# EasyEDA schematic 原理图.json
TITLE: Sheet_1; REV: 1.0; Date: 2021-08-09; Sheet: 1/1; Drawn By: pomin; Company: Your Company
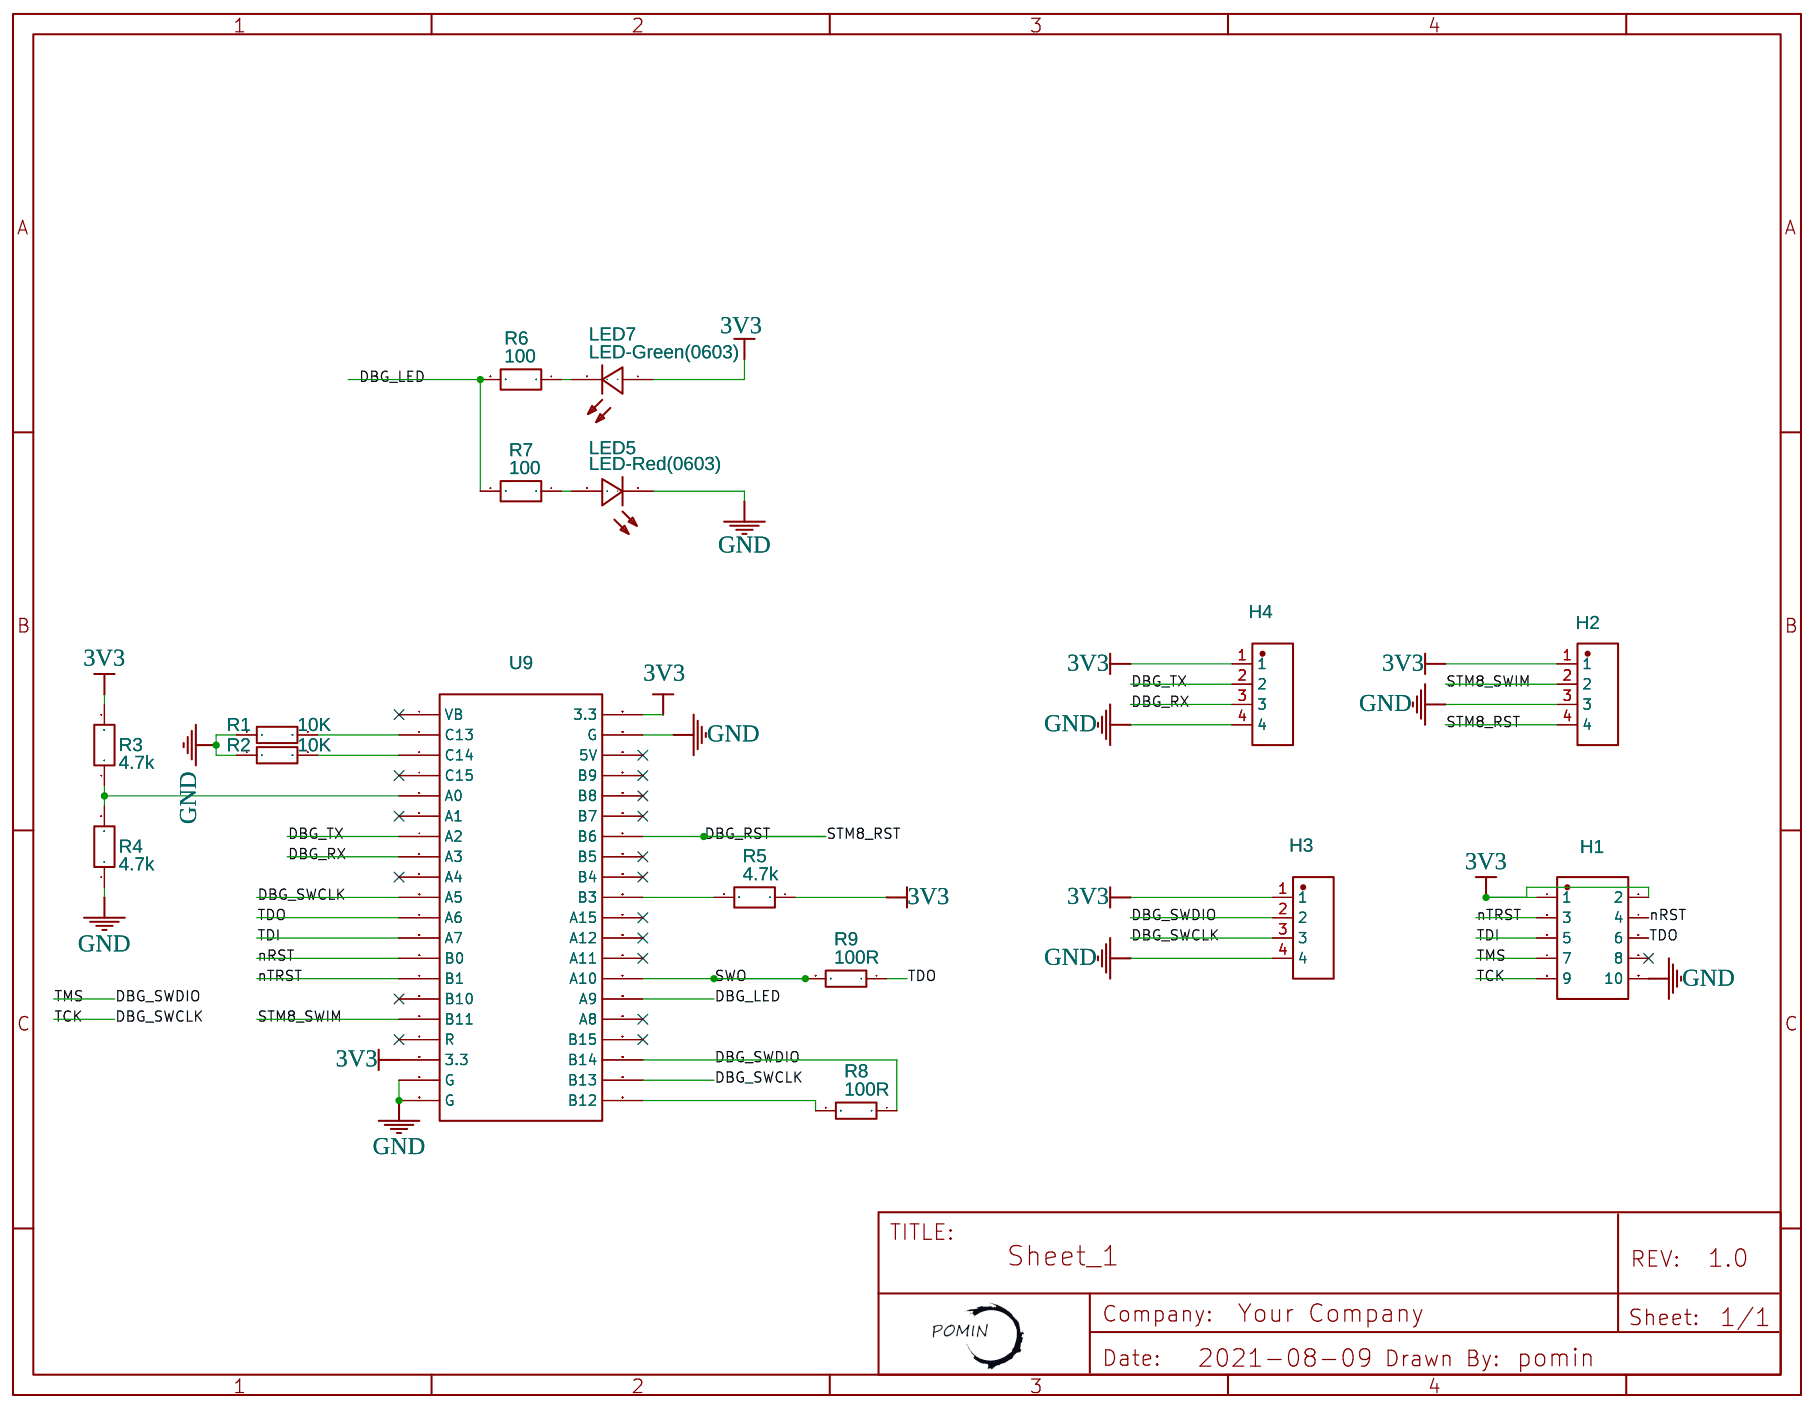
[diagram p0: schematic sheet]

## Parts
H1  Female header2.54mm2*5p Straight  [HDR-TH_10P-P2.54-V-F-R2-C5-S2.54]
H2  2.54-1*4P母  [HDR-TH_4P-P2.54-V-F]
H3  2.54-1*4P母  [HDR-TH_4P-P2.54-V-F]
H4  2.54-1*4P母  [HDR-TH_4P-P2.54-V-F]
LED5  LED-Red(0603)  [LED-0805]
LED7  LED-Green(0603)  [LED-0805]
R1  10K  [0603]
R2  10K  [0603]
R3  4.7k  [0603]
R4  4.7k  [0603]
R5  4.7k  [0603]
R6  100  [RES_0805]
R7  100  [RES_0805]
R8  100R  [0603]
R9  100R  [0603]
U9  STM32F103C8T6核心板  [STM32F103C8T6核心板]

## Library data of the parts
H1 = Female header2.54mm2*5p Straight: Supplier Part: C30419; Supplier: LCSC; Manufacturer: ReliaPro; JLCPCB Part Class: Extended Part
H2-H4 = 2.54-1*4P母: Supplier: LCSC; Supplier Part: C2718488; Manufacturer: BOOMELE(博穆精密); Contributor: LCSC; JLCPCB Part Class: Extended Part
LED5 = -: Supplier: LCSC; Manufacturer: Hubei KENTO Elec; Manufacturer Part: KT-0603R; Supplier Part: C2286
LED7 = -: Supplier: LCSC; Manufacturer: Foshan NationStar Optoelectronics; Manufacturer Part: FC-DA1608UGK-520D10; Contributor: EasyEDA; Supplier Part: C84267
R1 R2 = RC0603DR-0710KL: Supplier: LCSC; Manufacturer: YAGEO; Manufacturer Part: AC0603FR-0710KL; Contributor: LCSC; Supplier Part: C116677
R3-R5 = Res_0603(1/10W)_EU: Manufacturer Part: AC0603FR-074K7L; Supplier: LCSC; Manufacturer: YAGEO; Supplier Part: C116697
R6 R7 = Res_0603(1/10W)_EU: Manufacturer Part: ?
R8 R9 = AC0603JR-07100RL: Supplier: LCSC; Supplier Part: C105588; Manufacturer: YAGEO; Manufacturer Part: RC0603FR-07100RL; Contributor: LCSC
U9 = STM32F103C8T6核心板: Contributor: lueluell

## Nets
3V3: H1.1 H1.2 H2.1 H3.1 H4.1 LED7.1(+) R3.2 R5.1 U9.18(3.3) U9.21(3.3)
GND: H1.10 H2.3 H3.4 H4.4 LED5.2(-) R1.1 R2.1 R4.1 U9.19(G) U9.20(G) U9.22(G)
DBG_LED: R6.2 R7.2 U9.35(A9)
DBG_RST: H2.4 U9.27(B6)
DBG_RX: H4.3 U9.8(A3)
DBG_SWCLK: H1.9 H3.3 U9.10(A5) U9.39(B13)
DBG_SWDIO: H1.7 H3.2 R8.1 U9.38(B14)
DBG_TX: H4.2 U9.7(A2)
nRST: H1.4 U9.13(B0)
nTRST: H1.3 U9.14(B1)
STM8_SWIM: H2.2 U9.16(B11)
SWO: R9.2 U9.34(A10)
TDI: H1.5 U9.12(A7)
TDO: H1.6 R9.1 U9.11(A6)
Net-(LED5-1): LED5.1(+) R7.1
Net-(LED7-2): LED7.2(-) R6.1
Net-(R1-2): R1.2 U9.2(C13)
Net-(R2-2): R2.2 U9.3(C14)
Net-(R3-1): R3.1 R4.2 U9.5(A0)
Net-(R5-2): R5.2 U9.30(B3)
Net-(R8-2): R8.2 U9.40(B12)

Not connected (* = marked no-connect by the designer): H1 8*; U9 1(VB)* 4(C15)* 6(A1)* 9(A4)* 15(B10)* 17(R)* 23(5V)* 24(B9)* 25(B8)* 26(B7)* 28(B5)* 29(B4)* 31(A15)* 32(A12)* 33(A11)* 36(A8)* 37(B15)*
